# Altium schematic sheet USB_CAN.SchDoc
size A3; Author: Швецов С.В.; Organization: PapuaSoft; SheetNumber: 3; SheetTotal: 8
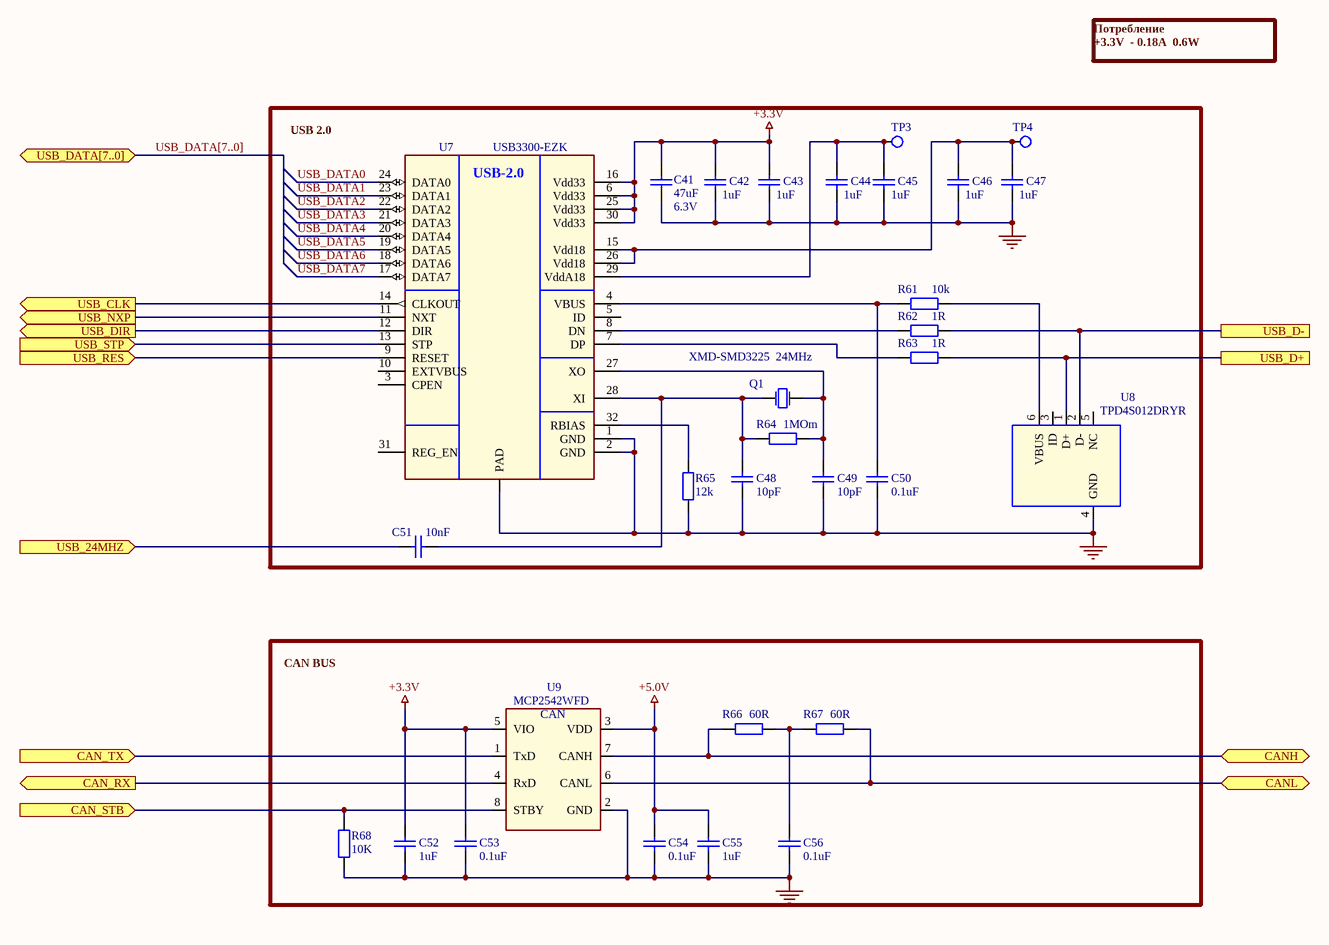
[diagram p0: USB_CAN.SchDoc]

## Parts
C41  value 47uF  Voltage: 6.3V  [C0805]  (hidden comment: Cap)
C42  value 1uF  [C0603]  (hidden comment: Cap)
C43  value 1uF  [C0603]  (hidden comment: Cap)
C44  value 1uF  [C0603]  (hidden comment: Cap)
C45  value 1uF  [C0603]  (hidden comment: Cap)
C46  value 1uF  [C0603]  (hidden comment: Cap)
C47  value 1uF  [C0603]  (hidden comment: Cap)
C48  value 10pF  [C0402]  (hidden comment: Cap)
C49  value 10pF  [C0402]  (hidden comment: Cap)
C50  value 0.1uF  [C0402]  (hidden comment: Cap)
C51  value 10nF  [C0402]  (hidden comment: Cap)
C52  value 1uF  [C0603]  (hidden comment: Cap)
C53  value 0.1uF  [C0402]  (hidden comment: Cap)
C54  value 0.1uF  [C0402]  (hidden comment: Cap)
C55  value 1uF  [C0603]  (hidden comment: Cap)
C56  value 0.1uF  [C0402]  (hidden comment: Cap)
Q1  XMD-SMD3225  24MHz  [KX-5T]
R61  value 10k  [R0402]  (hidden comment: Res2)
R62  value 1R  [R0402]  (hidden comment: Res2)
R63  value 1R  [R0402]  (hidden comment: Res2)
R64  value 1MOm  [R0402]  (hidden comment: Res2)
R65  value 12k  [R0402]  (hidden comment: Res2)
R66  value 60R  [R0402]  (hidden comment: Res2)
R67  value 60R  [R0402]  (hidden comment: Res2)
R68  value 10K  [R0402]  (hidden comment: Res2)
TP3  (no value)  [TP_0MM5_1MM0]  (no BOM)
TP4  (no value)  [TP_0MM5_1MM0]  (no BOM)
U7  USB3300-EZK  [QFN-32]
U8  value TPD4S012DRYR  [TPD4S012DRYR]
U9  MCP2542WFD  [SO8]

## Ports
CAN_RX (out), CAN_STB (in), CAN_TX (in), CANH (bidir), CANL (bidir), USB_24MHZ (in), USB_CLK (out), USB_D+, USB_D-, USB_DATA[7..0] (bidir), USB_DIR (out), USB_NXP (out), USB_RES (in), USB_STP (in)

## Nets
+3.3V: C41.1 C42.2 C43.2 C52.1 C53.1 U7.6(Vdd33) U7.16(Vdd33) U7.25(Vdd33) U7.30(Vdd33) U9.5(NC)
+5.0V: C54.1 C55.1 U9.3(VDD)
GND: C41.2 C42.1 C43.1 C44.1 C45.1 C46.1 C47.1 C48.2 C49.2 C50.2 C52.2 C53.2 C54.2 C55.2 C56.2 R65.2 R68.2 U7.0(PAD) U7.1(GND) U7.2(GND) U8.4(GND) U9.2(GND)
CAN_RX: U9.4(NC) ; port CAN_RX
CAN_STB: R68.1 U9.8(STBY) ; port CAN_STB
CAN_TX: U9.1(TxD) ; port CAN_TX
CANH: R66.2 U9.7(CANH) ; port CANH
CANL: R67.1 U9.6(CANL) ; port CANL
USB_24MHZ: C51.1 ; port USB_24MHZ
USB_CLK: U7.14(CLKOUT) ; port USB_CLK
USB_D+: R63.1 U8.1(D+) ; port USB_D+
USB_D-: R62.1 U8.2(D-) ; port USB_D-
USB_DATA0: U7.24(DATA0)
USB_DATA1: U7.23(DATA1)
USB_DATA2: U7.22(DATA2)
USB_DATA3: U7.21(DATA3)
USB_DATA4: U7.20(DATA4)
USB_DATA5: U7.19(DATA5)
USB_DATA6: U7.18(DATA6)
USB_DATA7: U7.17(DATA7)
USB_DIR: U7.12(DIR) ; port USB_DIR
USB_NXP: U7.11(NXT) ; port USB_NXP
USB_RES: U7.9(RESET) ; port USB_RES
USB_STP: U7.13(STP) ; port USB_STP
NetC44_2: C44.2 C45.2 TP3.1(e1) U7.29(VddA18)
NetC46_2: C46.2 C47.2 TP4.1(e1) U7.15(Vdd18) U7.26(Vdd18)
NetC48_1: C48.1 C51.2 Q1.1(OSC1) R64.1 U7.28(XI)
NetC49_1: C49.1 Q1.3(OSC2) R64.2 U7.27(XO)
NetC50_1: C50.1 R61.1 U7.4(VBUS)
NetC56_1: C56.1 R66.1 R67.2
NetR61_2: R61.2 U8.6(VBUS)
NetR62_2: R62.2 U7.8(DN)
NetR63_2: R63.2 U7.7(DP)
NetR65_1: R65.1 U7.32(RBIAS)

Not connected (* = marked no-connect by the designer): U7 3(CPEN) 5(ID) 10(EXTVBUS) 31(REG_EN); U8 3(ID) 5(NC)

## Buses and harness runs
bus USB_DATA[7..0] = port USB_DATA[7..0]

## Notes on the sheet
- Потребление
  +3.3V  - 0.18A  0.6W
- (near U7) USB 2.0
- CAN BUS
- Лист
- /
- Изм.
- № докум.
- Подп.
- Дата.
- (in symbol L7805) CAN
- (in symbol USB3300) USB-2.0

## Library data of the parts
C41 = Cap: C0805C476M9PAC; PackageReference: 0805; ClassName: Xilinx PWR
C42-C47 C52 C55 = Cap: Конденсатор керамический; PackageReference: 0603
  C42-C47: ClassName: USB-2.0
  C52 C55: ClassName: CAN BUS
C48 C49 = Cap: GRM1535C1H100J; PackageReference: 0402; ClassName: USB-2.0
C50 C51 C53 C54 C56 = Cap: Конденсатор керамический; Voltage: 25V; PackageReference: 0402
  C50 C51: ClassName: USB-2.0
  C53 C54 C56: ClassName: CAN BUS
Q1 = XTAL: Chengdu Kingbri Frequency Technology Co., Ltd   24MHz; Value: 01XMD118JVF0024000000; PackageReference: SMD 3.2x2.5мм; ClassName: USB-2.0
R61-R64 R66-R68 = Res2: Резистор; PackageReference: 0402
  R61-R64: ClassName: USB-2.0
  R66-R68: ClassName: CAN BUS
R65 = Res2: Резистор; Precision: 1%; PackageReference: 0402; ClassName: USB-2.0
TP3 TP4 = Test_Point: Тестовая точка на плате; MarkPCB: +5V; ClassName: USB-2.0
U7 = USB3300: USB-2.0 driver; Value: USB3300-EZK; PackageReference: QFN32
U8 = TPD4S012DRYR: Защитные диоды USB; PackageReference: SON6; ClassName: USB-2.0
U9 = L7805: CAN Transceiver; PackageReference: SO8; Value: MCP2542WFD; ClassName: CAN BUS